# Altium schematic sheet ZYNQ-TEMP.SchDoc
size A3; SheetNumber: 10; SheetTotal: 10
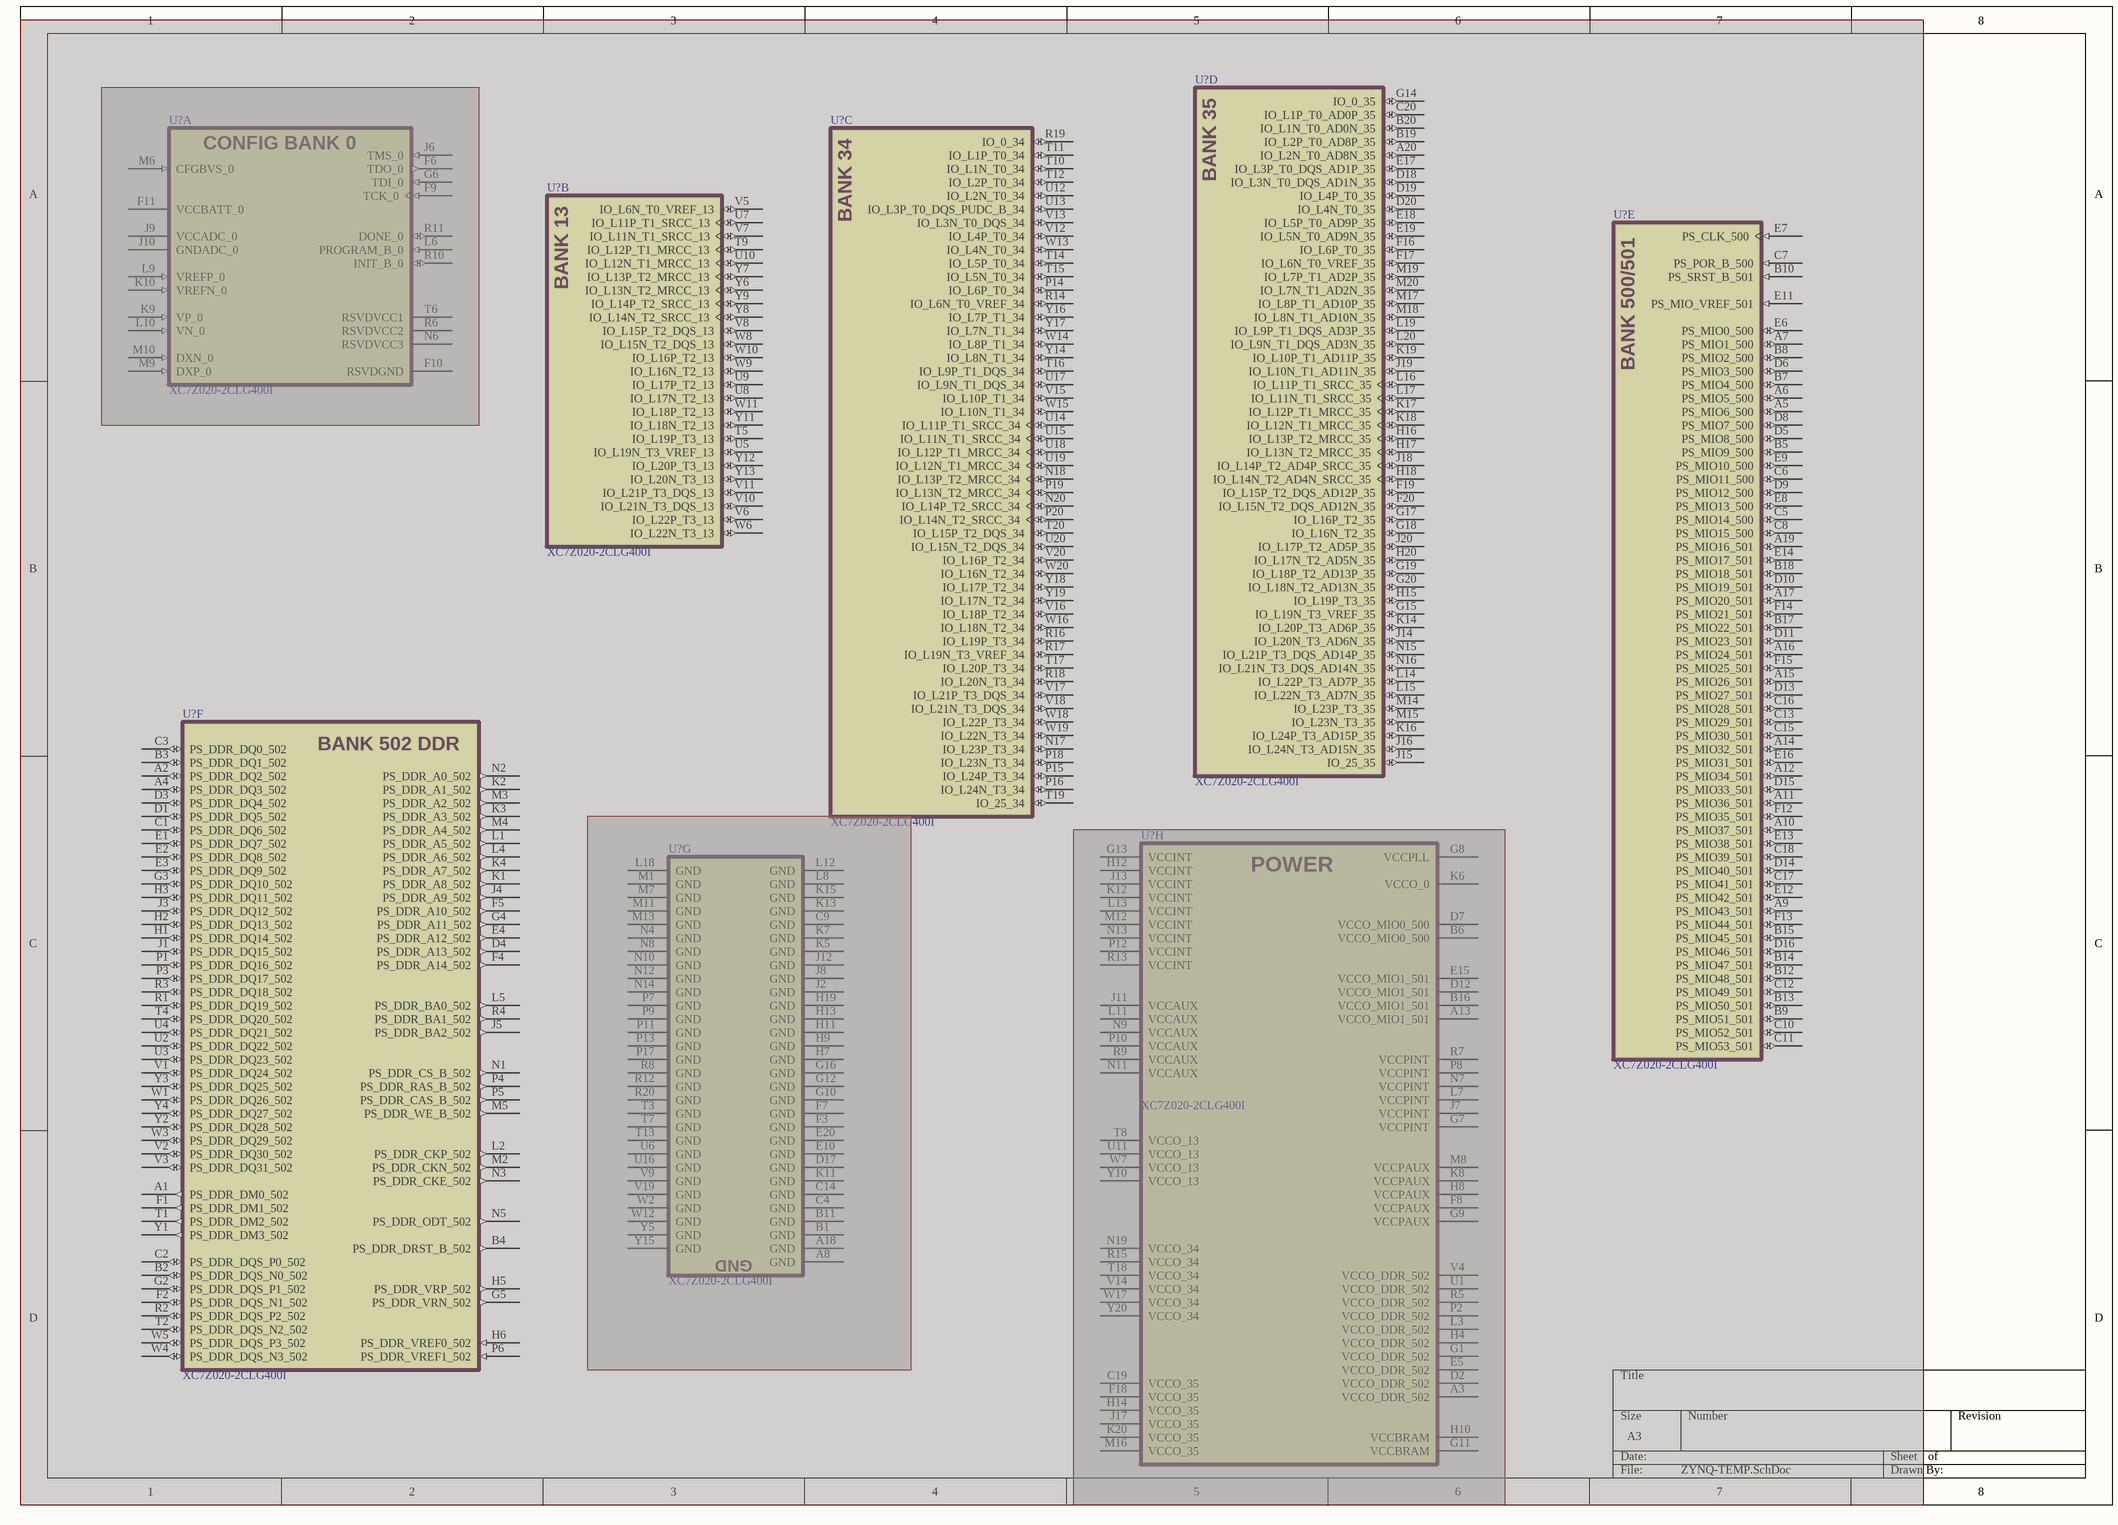
[diagram p0: ZYNQ-TEMP.SchDoc]

## Parts
(Parts that share a designator on the sheet are numbered #1, #2 ... from top to bottom, then left to right.)
U?#1  XC7Z020-2CLG400I  [BGA400C80P20X20_1700X1700X147]  (part D of 8)  (masked out: inside a compile mask, not in the netlist)
U?#2  XC7Z020-2CLG400I  [BGA400C80P20X20_1700X1700X147]  (part A of 8)  (masked out: inside a compile mask, not in the netlist)
U?#3  XC7Z020-2CLG400I  [BGA400C80P20X20_1700X1700X147]  (part C of 8)  (masked out: inside a compile mask, not in the netlist)
U?#4  XC7Z020-2CLG400I  [BGA400C80P20X20_1700X1700X147]  (part B of 8)  (masked out: inside a compile mask, not in the netlist)
U?#5  XC7Z020-2CLG400I  [BGA400C80P20X20_1700X1700X147]  (part E of 8)  (masked out: inside a compile mask, not in the netlist)
U?#6  XC7Z020-2CLG400I  [BGA400C80P20X20_1700X1700X147]  (part F of 8)  (masked out: inside a compile mask, not in the netlist)
U?#7  XC7Z020-2CLG400I  [BGA400C80P20X20_1700X1700X147]  (part H of 8)  (masked out: inside a compile mask, not in the netlist)
U?#8  XC7Z020-2CLG400I  [BGA400C80P20X20_1700X1700X147]  (part G of 8)  (masked out: inside a compile mask, not in the netlist)

## Notes on the sheet
- (in symbol XC7Z020-2CLG400I, part A) CONFIG BANK 0
- (in symbol XC7Z020-2CLG400I, part B) BANK 13
- (in symbol XC7Z020-2CLG400I, part C) BANK 34
- (in symbol XC7Z020-2CLG400I, part D) BANK 35
- (in symbol XC7Z020-2CLG400I, part E) BANK 500/501
- (in symbol XC7Z020-2CLG400I, part F) BANK 502 DDR
- (in symbol XC7Z020-2CLG400I, part H) POWER

## Library data of the parts
U?#1-U?#8 = XC7Z020-2CLG400I: Dual ARM® Cortex®-A9 MPCore™ with CoreSight™ System On Chip (SOC) IC Zynq®-7000 Artix™-7 FPGA, 85K Logic Cells 766MHz 400-CSPBGA (17x17); Manufacturer: AMD/XILINX; MPN: XC7Z020-2CLG400I; ComponentLink1Description: Datasheet; ComponentLink1URL: https://docs.amd.com/v/u/en-US/ds190-Zynq-7000-Overview; ComponentLink2Description: DC and AC Switching Characteristics; ComponentLink2URL: https://docs.amd.com/v/u/en-US/ds187-XC7Z010-XC7Z020-Data-Sheet; ComponentLink3Description: PCB Design Guide; ComponentLink3URL: https://docs.amd.com/v/u/en-US/ug933-Zynq-7000-PCB; ComponentLink4Description: Packaging and Pinout; ComponentLink4URL: https://docs.amd.com/v/u/en-US/ug865-Zynq-7000-Pkg-Pinout; ComponentLink5Description: Zynq 7000 SoC Technical Reference Manual; ComponentLink5URL: https://docs.amd.com/r/en-US/ug585-zynq-7000-SoC-TRM